# EAGLE design Left (EAGLE 8.2.1)
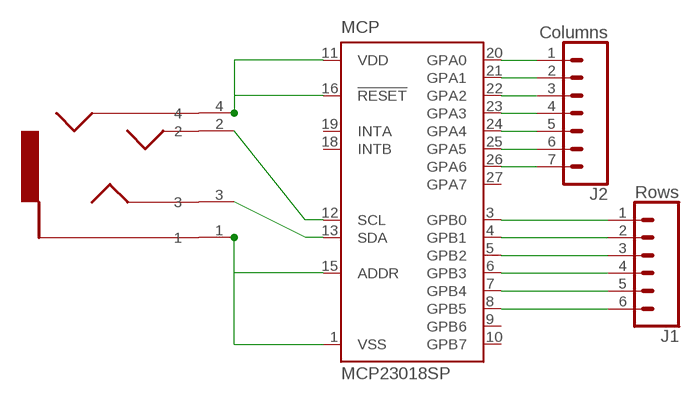
[diagram p0: schematic, sheet 1]

## Parts
J1  Rows  CONN_06SILK_FEMALE_PTH  [1X06]
J2  Columns  CONN_07  [1X07]
MCP  MCP23018SP  [DIL28-3]
U$1  SJ-43514_HEADPHONES_3.5MM_X4  [SJ-43514_HEADPHONES-3.5MM_X4]

## Nets
N$1: MCP.1(VSS) MCP.15(ADDR) U$1.1
N$2: MCP.11(VDD) MCP.16(!RESET) U$1.4
N$3: MCP.13(SDA) U$1.3
N$4: MCP.12(SCL) U$1.2
N$5: J2.1 MCP.20(GPA0)
N$6: J2.2 MCP.21(GPA1)
N$7: J2.3 MCP.22(GPA2)
N$8: J2.4 MCP.23(GPA3)
N$9: J2.5 MCP.24(GPA4)
N$10: J2.6 MCP.25(GPA5)
N$11: J2.7 MCP.26(GPA6)
N$12: J1.1 MCP.3(GPB0)
N$13: J1.2 MCP.4(GPB1)
N$14: J1.3 MCP.5(GPB2)
N$15: J1.4 MCP.6(GPB3)
N$16: J1.5 MCP.7(GPB4)
N$17: J1.6 MCP.8(GPB5)
Unconnected: MCP.9(GPB6) MCP.10(GPB7) MCP.18(INTB) MCP.19(INTA) MCP.27(GPA7)

## Library data of the parts
J1 = SparkFun-Connectors:CONN_06: Multi connection point. Often used as Generic Header-pin footprint for 0.1 inch spaced/style header connections On any of the 0.1 inch spaced packages, you can populate with these: Break Away Headers - Straight <https://www.sparkfun.com/products/116> (PRT-00116) Break Away Male Headers - Right Angle <https://www.sparkfun.com/products/553> (PRT-00553) Female Headers <https://www.sparkfun.com/products/115> (PRT-00115) Break Away Headers - Machine Pin <https://www.sparkfun.com/products/117> (PRT-00117) Break Away Female Headers - Swiss Machine Pin <https://www.sparkfun.com/products/743> (PRT-00743) Arduino Stackable Header - 6 Pin <https://www.sparkfun.com/products/9280> (PRT-09280) For SCREWTERMINALS and SPRING TERMINALS visit here: Screw Terimnals on SparkFun.com <https://www.sparkfun.com/search/results?term=Screw+Terminals> (5mm/3.5mm/2.54mm spacing) This device is also useful as a general connection point to wire up your design to another part of your project. Our various solder wires solder well into these plated through hole pads. Hook-Up Wire - Assortment (Stranded, 22 AWG) <https://www.sparkfun.com/products/11375> (PRT-11375) Hook-Up Wire - Assortment (Solid Core, 22 AWG) <https://www.sparkfun.com/products/11367> (PRT-11367) View the entire wire category on our website here <https://www.sparkfun.com/categories/141>; PROD_ID: CONN-08437
J2 = SparkFun-Connectors:CONN_07: Multi connection point. Often used as Generic Header-pin footprint for 0.1 inch spaced/style header connections On any of the 0.1 inch spaced packages, you can populate with these: Break Away Headers - Straight <https://www.sparkfun.com/products/116> (PRT-00116) Break Away Male Headers - Right Angle <https://www.sparkfun.com/products/553> (PRT-00553) Female Headers <https://www.sparkfun.com/products/115> (PRT-00115) Break Away Headers - Machine Pin <https://www.sparkfun.com/products/117> (PRT-00117) Break Away Female Headers - Swiss Machine Pin <https://www.sparkfun.com/products/743> (PRT-00743) For SCREWTERMINALS and SPRING TERMINALS visit here: Screw Terimnals on SparkFun.com <https://www.sparkfun.com/search/results?term=Screw+Terminals> (5mm/3.5mm/2.54mm spacing) This device is also useful as a general connection point to wire up your design to another part of your project. Our various solder wires solder well into these plated through hole pads. Hook-Up Wire - Assortment (Stranded, 22 AWG) <https://www.sparkfun.com/products/11375> (PRT-11375) Hook-Up Wire - Assortment (Solid Core, 22 AWG) <https://www.sparkfun.com/products/11367> (PRT-11367) View the entire wire category on our website here <https://www.sparkfun.com/categories/141> Special notes: Molex polarized connector foot print use with SKU : PRT-08231 with associated crimp pins and housings. 1MM SMD Version SKU: PRT-10208 NOTES ON THE VARIANTS LOCK and LOCK_LONGPADS... This footprint was designed to help hold the alignment of a through-hole component (i.e. 6-pin header) while soldering it into place. You may notice that each hole has been shifted either up or down by 0.005 of an inch from it's more standard position (which is a perfectly straight line). This slight alteration caused the pins (the squares in the middle) to touch the edges of the holes. Because they are alternating, it causes a "brace" to hold the component in place. 0.005 has proven to be the perfect amount of "off-center" position when using our standard breakaway headers. Although looks a little odd when you look at the bare footprint, once you have a header in there, the alteration is very hard to notice. Also,if you push a header all the way into place, it is covered up entirely on the bottom side.
MCP = microchip-23018:MCP23018: http://ww1.microchip.com/downloads/en/DeviceDoc/22103a.pdf Source: http://ww1.microchip.com/downloads/en/DeviceDoc/22103a.pdf; MF: MICROCHIP; MPN: MCP23018-E/SP; OC_NEWARK: 98M1583
U$1 = my_parts:SJ-43514_HEADPHONES_3.5MM_X4: This is for the SJ-43514 3.5mm 4-conductor headphone jack. Also works with SJ-4351X and SJ-43515TS

## Board
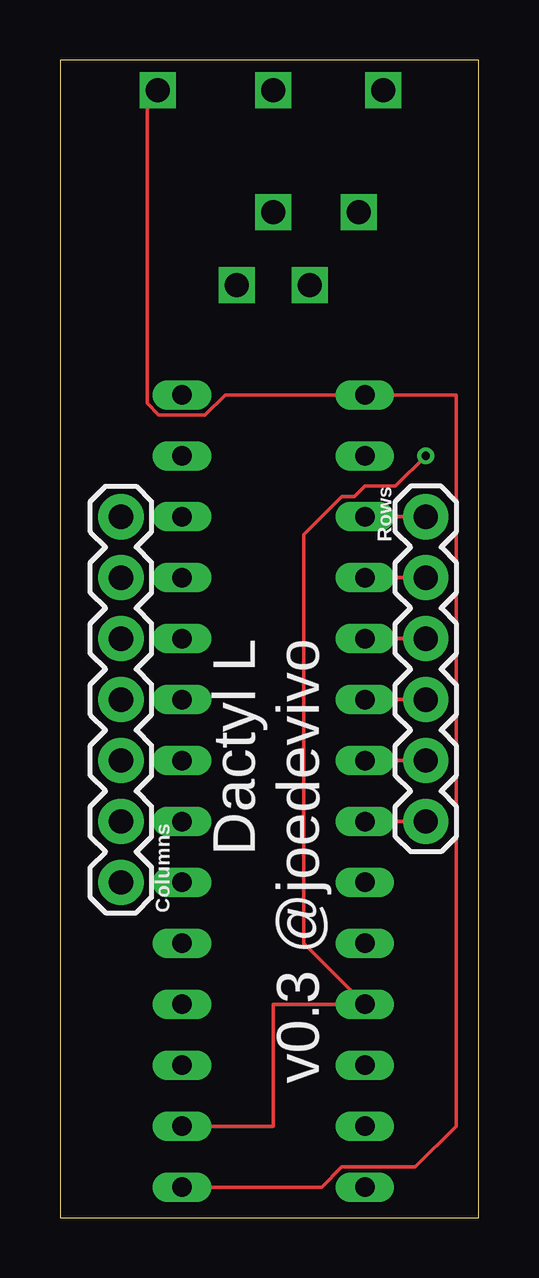
[diagram p1: board, top side]
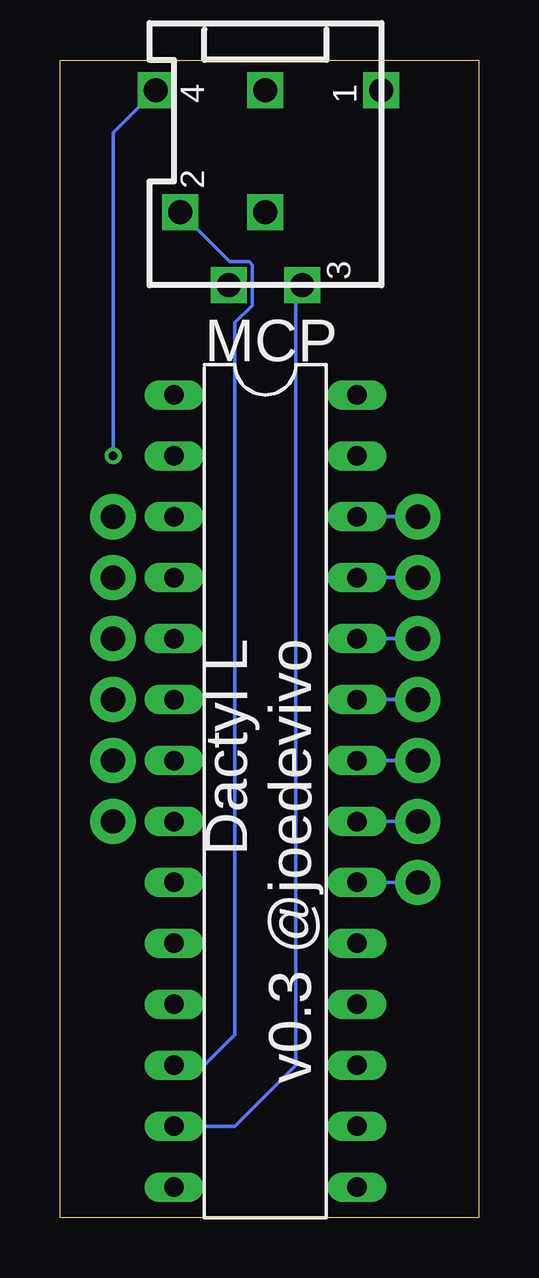
[diagram p2: board, bottom side, seen from below]

Size 17.45 x 48.25 mm. Coordinates in mm from the lower left corner, seen from the top.
Outline: 0,0 17.45,0 17.45,48.25 0,48.25 0,0
Copper layers (1*16): Top 0.0356mm / dielectric 1.5011mm / Bottom 0.0356mm
Design rules "oshpark-2layer": minimum track width 6mil, minimum drill 13mil, track to track 6mil, track to pad 6mil, pad to pad 6mil, via to via 6mil, smd to smd 6mil, copper to edge 15mil, drill to drill 6mil, minimum pad ring 7mil, minimum via ring 7mil, stop-mask expansion 2.5mil, vias tented up to drill 0mil, thermal gap 10mil

### Footprints (pad centres in the part's own frame; a part is rotated, then mirrored left to right if it is on the bottom)
1X06 = drill 1.016 pad 1.88: 1 0,0; 2 2.54,0; 3 5.08,0; 4 7.62,0; 5 10.16,0; 6 12.7,0
1X07 = drill 1.016 pad 1.88: 1 0,0; 2 2.54,0; 3 5.08,0; 4 7.62,0; 5 10.16,0; 6 12.7,0; 7 15.24,0
DIL28-3 = drill 0.813 long: 1 -16.51,-3.81; 2 -13.97,-3.81; 3 -11.43,-3.81; 4 -8.89,-3.81; 5 -6.35,-3.81; 6 -3.81,-3.81; 7 -1.27,-3.81; 8 1.27,-3.81; 9 3.81,-3.81; 10 6.35,-3.81; 11 8.89,-3.81; 12 11.43,-3.81; 13 13.97,-3.81; 14 16.51,-3.81; 15 16.51,3.81; 16 13.97,3.81; 17 11.43,3.81; 18 8.89,3.81; 19 6.35,3.81; 20 3.81,3.81; 21 1.27,3.81; 22 -1.27,3.81; 23 -3.81,3.81; 24 -6.35,3.81; 25 -8.89,3.81; 26 -11.43,3.81; 27 -13.97,3.81; 28 -16.51,3.81
SJ-43514_HEADPHONES-3.5MM_X4 = drill 1 square: 1 0,4.826; 2 5.08,-3.556; 3 8.128,1.524; 4 0,-4.572; 5 8.128,-1.524; NC 0,0; NC2 5.08,0

### Placement (x,y rotation side)
J1  15.24,29.21 270 top
J2  2.54,13.97 90 top
MCP  8.89,17.78 270 bottom
U$1  8.89,46.99 270 bottom

### Tracks (layer width: path | path; a pad name or v marks a point on that pad's centre or on a via)
N$1
  Top 0.152: MCP.15 10.91,1.27 11.74,2.11 14.81,2.11 16.51,3.81 16.51,34.29 MCP.1 6.88,34.29 6.04,33.45 4.12,33.45 3.63,33.94 3.63,46.56 U$1.1
N$2  (via drill 0.35)
  Top 0.152: MCP.16 8.89,3.81 8.89,8.89 MCP.11 10.16,11.43 10.16,28.46 11.74,30.05 12.27,30.05 12.7,30.48 13.97,30.48 v15.24,31.75
  Bottom 0.152: v15.24,31.75 15.24,45.21 U$1.4
N$3
  Bottom 0.152: MCP.13 10.16,3.81 7.62,6.35 7.62,38.61 U$1.3
N$4
  Bottom 0.152: MCP.12 11.43,6.35 10.16,7.62 10.16,37.29 9.44,38.02 9.44,39.71 9.57,39.84 10.38,39.84 U$1.2
N$5
  Bottom 0.152: MCP.20 J2.1
N$6
  Bottom 0.152: MCP.21 J2.2
N$7
  Bottom 0.152: MCP.22 J2.3
N$8
  Bottom 0.152: MCP.23 J2.4
N$9
  Bottom 0.152: MCP.24 J2.5
N$10
  Bottom 0.152: MCP.25 J2.6
N$11
  Bottom 0.152: MCP.26 J2.7
N$12
  Top 0.152: J1.1 MCP.3
N$13
  Top 0.152: J1.2 MCP.4
N$14
  Top 0.152: J1.3 MCP.5
N$15
  Top 0.152: J1.4 MCP.6
N$16
  Top 0.152: J1.5 MCP.7
N$17
  Top 0.152: J1.6 MCP.8

### Text on the board
tNames: Dactyl L / v0.3 @joedevivo
bNames: Dactyl L / v0.3 @joedevivo